# EAGLE design ExternalLEDs (EAGLE 8.3.2)
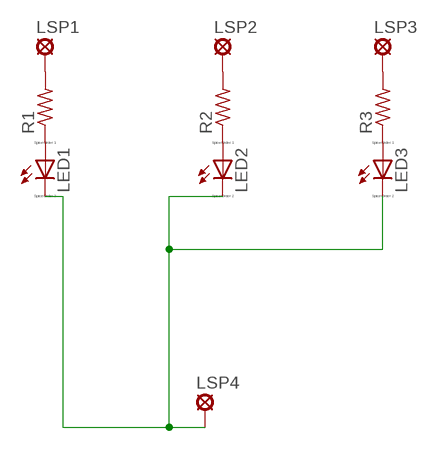
[diagram p0: schematic, sheet 1]

## Parts
LED1  LED_E  [LED_1206]
LED2  LED_E  [LED_1206]
LED3  LED_E  [LED_1206]
LSP1  LSP11  [LSP11]
LSP2  LSP11  [LSP11]
LSP3  LSP11  [LSP11]
LSP4  LSP11  [LSP11]
R1  R-US_0204/7  [0204/7]
R2  R-US_0204/7  [0204/7]
R3  R-US_0204/7  [0204/7]

## Nets
N$1: LSP1.MP R1.2
N$2: LSP2.MP R2.2
N$3: LSP3.MP R3.2
N$4: LED1.A R1.1
N$5: LED2.A R2.1
N$6: LED3.A R3.1
N$7: LED1.C LED2.C LED3.C LSP4.MP

## Library data of the parts
LED1-LED3 = eagle-ltspice:LED_E: LED Source: http://www.osram.convergy.de Source: www.luxeon.com Source: www.kingbright.com; SPICEMODEL: NONE; SPICEPREFIX: D; SPICETYPE: diode
LSP1-LSP4 = solpad:LSP11: SOLDER PAD drill 1.1 mm
R1-R3 = rcl:R-US_: RESISTOR, American symbol

## Board
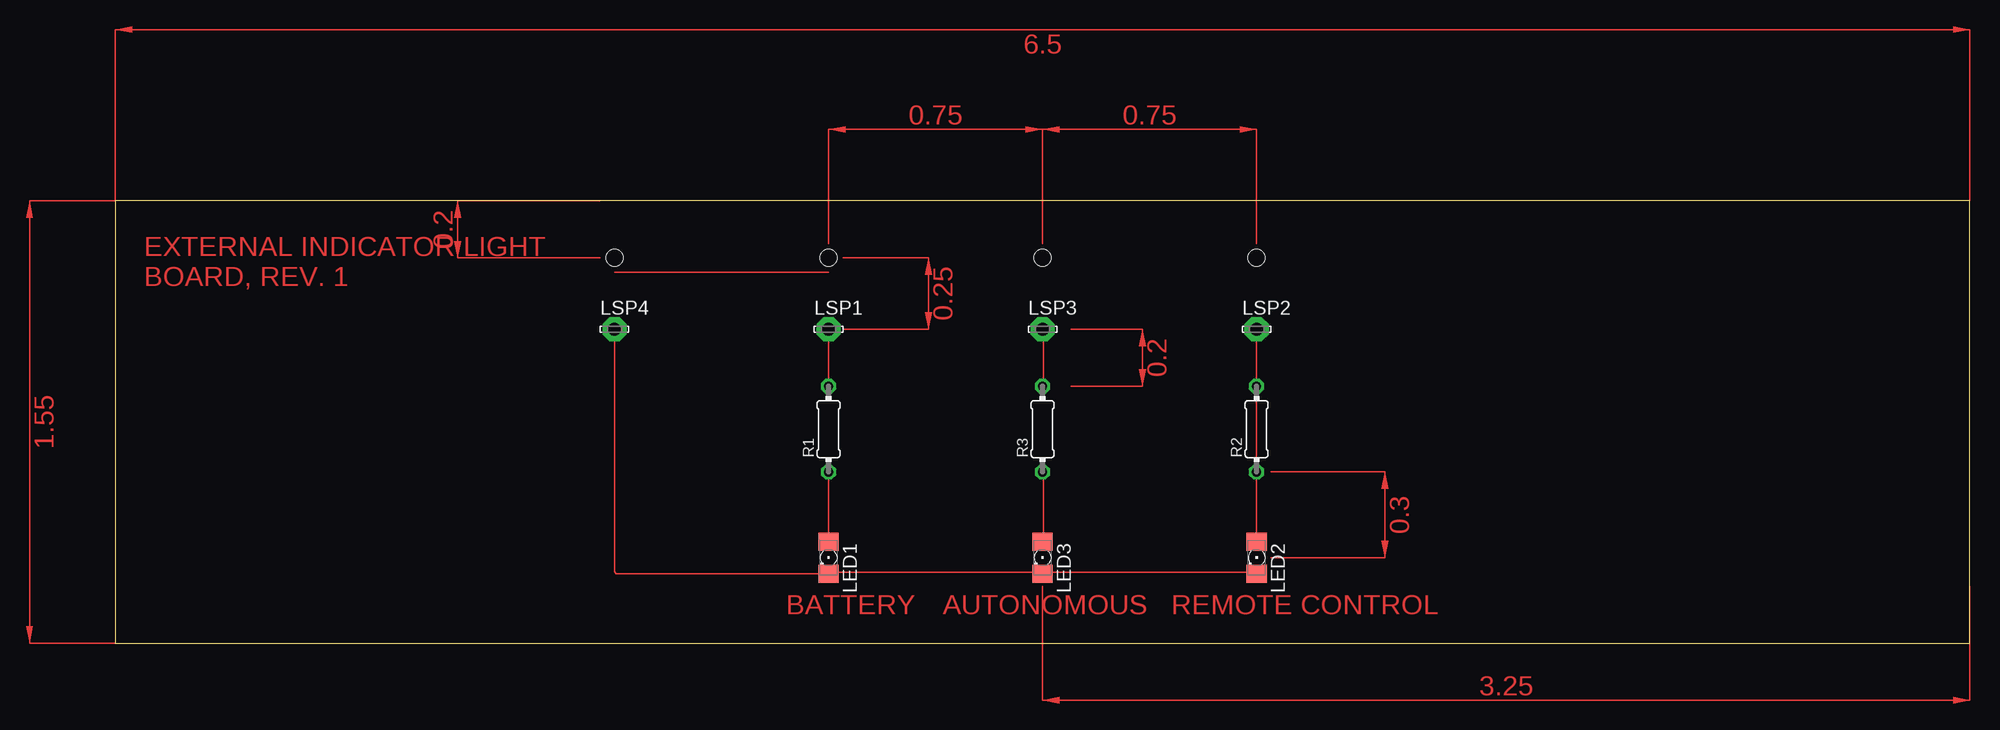
[diagram p1: board, top side]

Size 165.1 x 39.37 mm. Coordinates in mm from the lower left corner, seen from the top.
Outline: 0,0 165.08,0 165.1,39.37 0,39.37 0,0
Copper layers (1*16): Top 0.035mm / dielectric 1.5mm / Bottom 0.035mm
Design rules "default": minimum track width 6mil, minimum drill 0.35mm, track to track 6mil, track to pad 6mil, pad to pad 6mil, via to via 6mil, smd to smd 6mil, copper to edge 40mil, drill to drill 6mil, minimum pad ring 10mil, minimum via ring 8mil, stop-mask expansion 4mil, vias tented up to drill 0mil, thermal gap 10mil
Holes 1.5 mm at 44.45,34.29 63.5,34.29 101.6,34.29 82.55,34.29

### Footprints (pad centres in the part's own frame; a part is rotated, then mirrored left to right if it is on the bottom)
LED_1206 = smd 1.6 x 1.803: A -1.422,0; C 1.422,0
LSP11 = drill 1.118 pad 2.159 octagon: MP 0,0
0204/7 = drill 0.813 octagon: 1 -3.81,0; 2 3.81,0

### Placement (x,y rotation side)
LED1  63.5,7.62 270 top
LED2  101.6,7.62 270 top
LED3  82.55,7.62 270 top
LSP1  63.5,27.94 0 top
LSP2  101.6,27.94 0 top
LSP3  82.55,27.94 0 top
LSP4  44.45,27.94 0 top
R1  63.5,19.05 90 top
R2  101.6,19.05 90 top
R3  82.55,19.05 90 top

### Tracks (layer width: path | path; a pad name or v marks a point on that pad's centre or on a via)
N$1
  Top 0.152: LSP1.MP R1.2
N$2
  Top 0.152: LSP2.MP R2.2
N$3
  Top 0.152: R3.2 82.65,22.91 82.65,27.94 LSP3.MP
N$4
  Top 0.152: R1.1 LED1.A
N$5
  Top 0.152: R2.1 LED2.A
N$6
  Top 0.152: LED3.A 82.65,9.04 82.65,15.14 R3.1
N$7
  Top 0.152: LED3.C 82.5,6.3 63.5,6.3 LED1.C 44.6,6.2 44.45,6.35 LSP4.MP | LED2.C 101.6,6.3 82.65,6.3 LED3.C | 82.65,6.15 LED3.C
(copper drawn outside any net)
  shapes: Top area x12

### Text on the board
Top: EXTERNAL INDICATOR LIGHT / BOARD, REV. 1 | BATTERY | AUTONOMOUS | REMOTE CONTROL